# Altium project pca10040.PrjPCB (part 1 of 3)
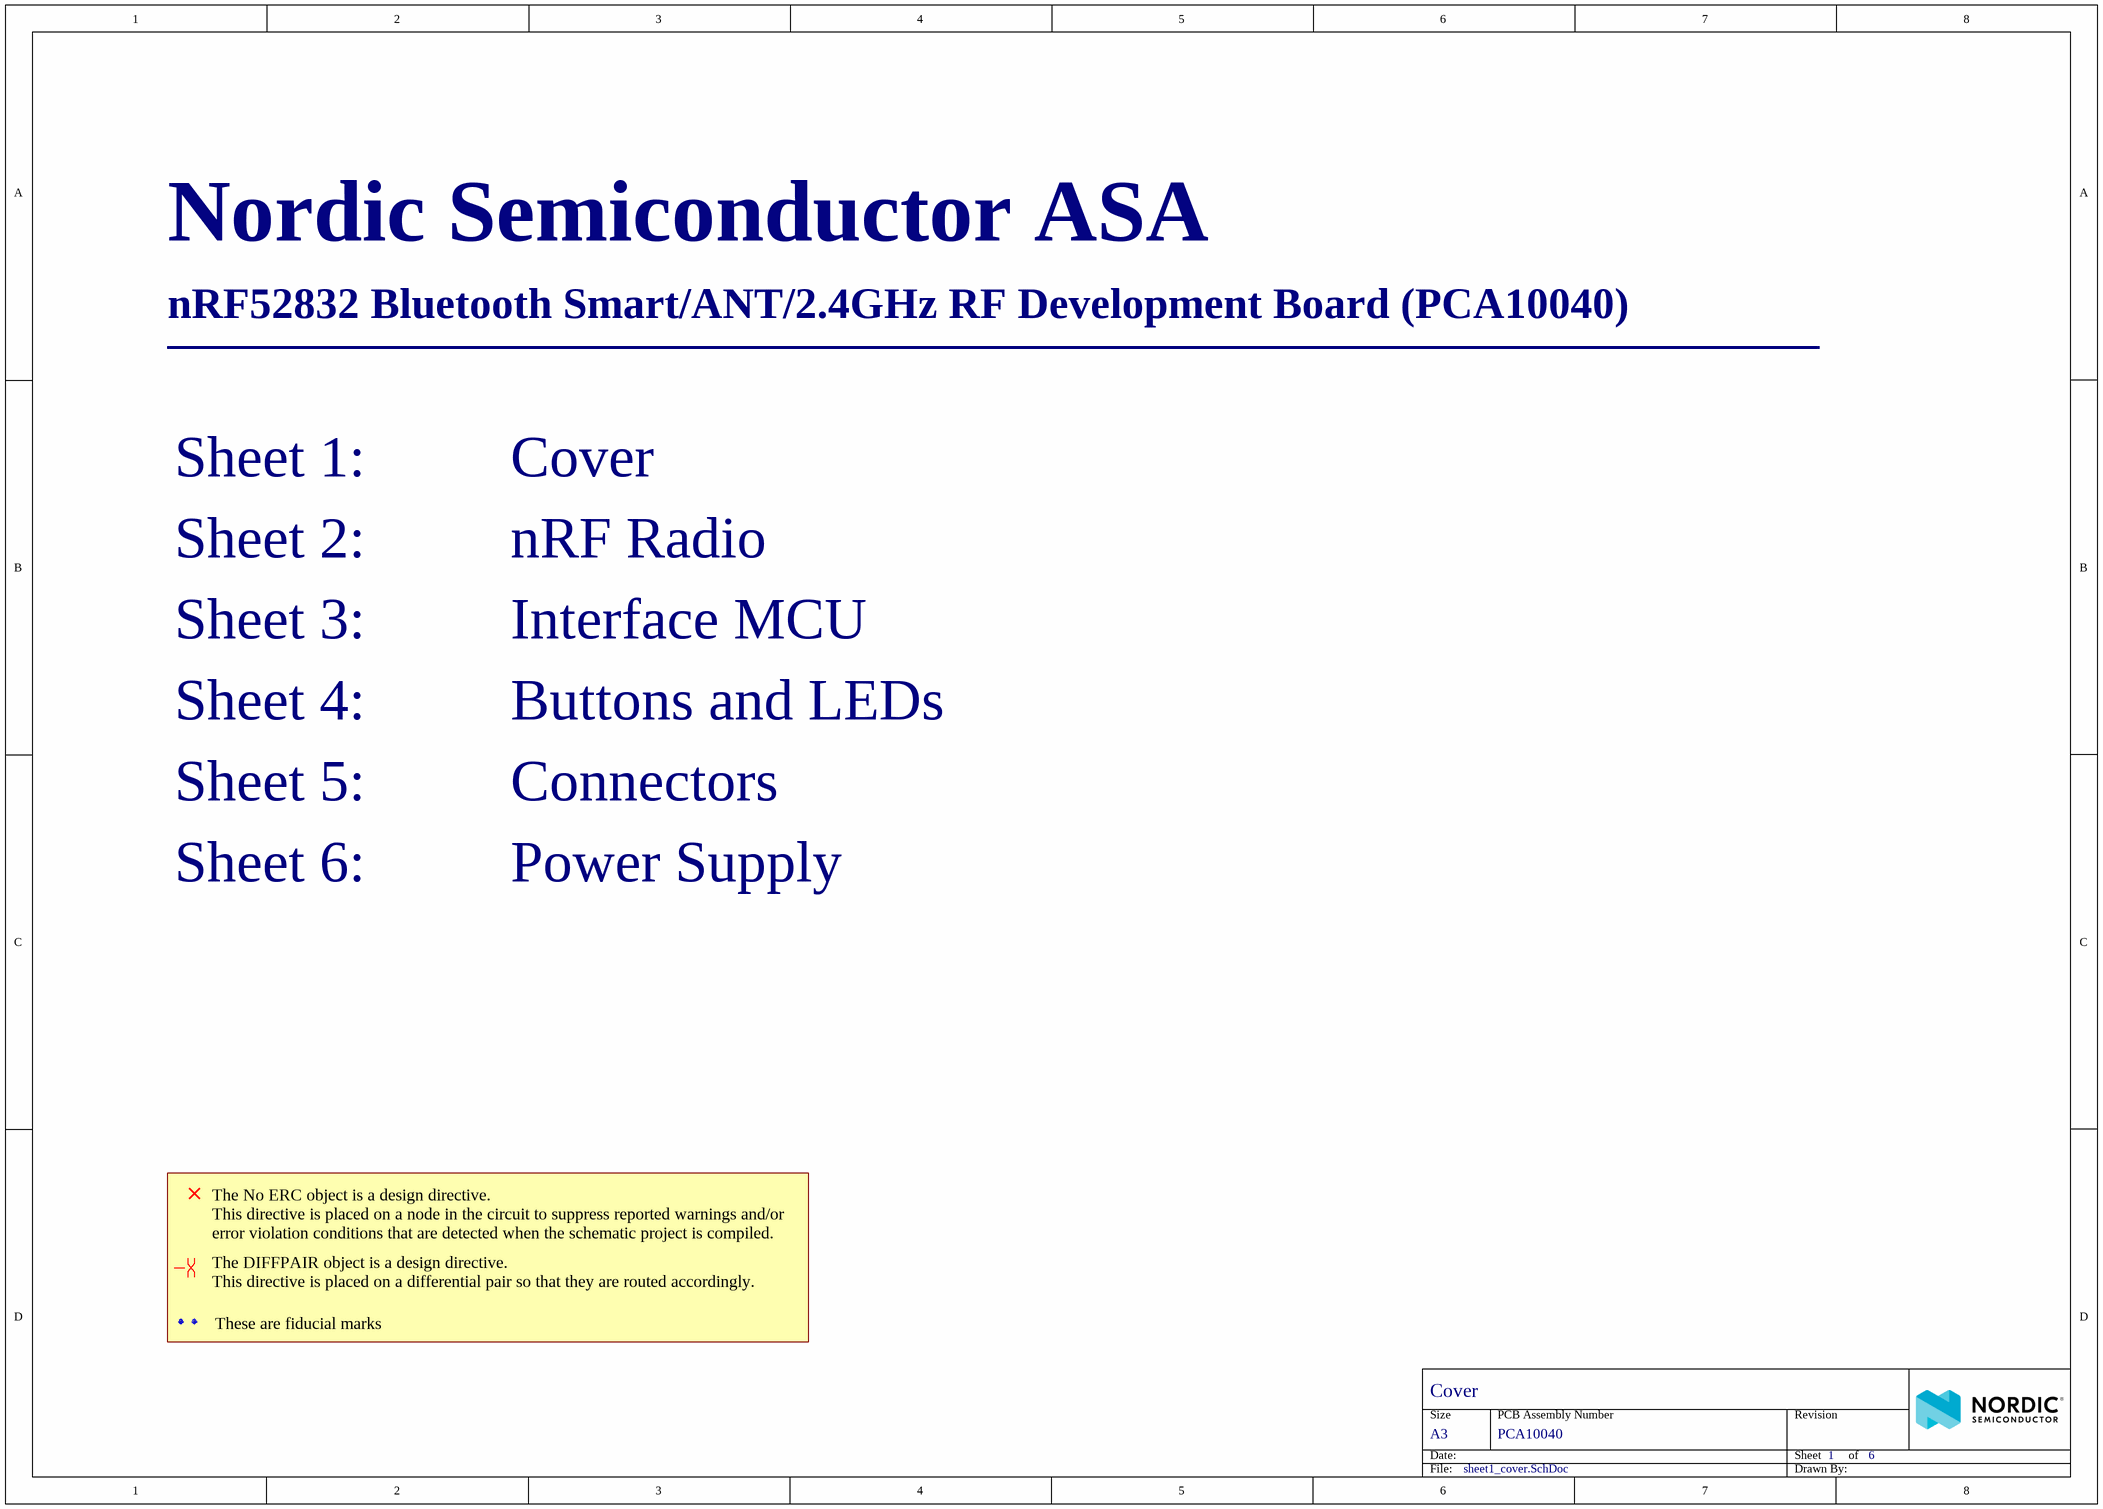
[diagram p0: sheet1_cover.SchDoc]
SurfaceFinish: ENIG; SoldermaskColor: Blue; SilkscreenColor: White; PCARevision: 3.0.0; ProductName: nRF52 DK; PCBStackup: 4001; PCBRevision: 0413RUBR; PCBNumber: 400150; PCAName: PCA10040; Organization: Nordic Semiconductor; NrOfLayers: 4; Dielectric: FR-4; Compliance: RoHS, REACH; BoardTitle: nRF52832 Development Board; BoardThickness: 1.6mm; Designer: KJP/RUBR/GETR/SIGE
6 sheets, 241 parts. Net scope: flat (ports and power ports of the same name join across sheets).
Board file: 400150.PcbDoc
Sheets:
  sheet1_cover.SchDoc
  sheet2_radio.SchDoc
  sheet3_interface_mcu.SchDoc
  sheet4_buttons_and_leds.SchDoc
  sheet5_connectors.SchDoc
  sheet6_power_supply.SchDoc

## Sheet sheet1_cover.SchDoc: Cover
size A3; Organization: Nordic Semiconductor; DocumentNumber: 1; Revision: 3.0.0; SheetNumber: 1; SheetTotal: 6; Author: KJP/RUBR/GETR/SIGE; CompanyName: Nordic Semiconductor; DrawnBy: KJP/RUBR/GETR/SIGE; DocumentSize: A3

### Parts
Fid1  Fiducial mark  [Fiducial]  (value not drawn)
Fid2  Fiducial mark  [Fiducial]  (value not drawn)

### Layout directives
differential pair: (no net found under the mark)

### Notes on the sheet
- Nordic Semiconductor ASA
- nRF52832 Bluetooth Smart/ANT/2.4GHz RF Development Board (PCA10040)
- ________________________________________________________
- Sheet 1:          Cover
- Sheet 2:          nRF Radio
- Sheet 3:          Interface MCU
- Sheet 4:          Buttons and LEDs
- Sheet 5:          Connectors
- Sheet 6:          Power Supply
- The No ERC object is a design directive.
  This directive is placed on a node in the circuit to suppress reported warnings and/or error violation conditions that are detected when the schematic project is compiled.
- The DIFFPAIR object is a design directive.
  This directive is placed on a differential pair so that they are routed accordingly.
- These are fiducial marks
- Size
- Date:
- A3
- PCB Assembly Number
- Sheet         of
- Revision
- File:
- Drawn By:

### Library data of the parts
Fid1 Fid2 = Fid-Mark: Manufacturer: N.A.; Value: N.A.; Pad Count: 1; Part Number: Fid-Mark; Manufacturer Part Number: N.A.; LatestRevisionDate: 2009-12-12; Published: 2009-12-12; Note: N.A.; Artikkelnr Noca: N.A.; Footprint Doc: Fiducial; Part number IPS: N.A.; ComponentLink1URL: N.A.; ComponentLink1Description: Datasheet; ComponentLink2URL: N.A.; ComponentLink2Description: Supplier link; HelpURL: N.A.; Supplier 1: N.A.; Supplier Part Number 1: N.A.; Supplier 2: N.A.; Supplier Part Number 2: N.A.; PartId: 100500073; Component Class: Connectors; Author: rsk; Part number Norautron: N.A.

## Sheet sheet2_radio.SchDoc: nRF52832 MCU
size A3; Organization: Nordic Semiconductor; DocumentNumber: 2; Revision: 3.0.0; SheetNumber: 2; SheetTotal: 6; Author: KJP/RUBR/GETR/SIGE; CompanyName: Nordic Semiconductor; DrawnBy: KJP/RUBR/GETR/SIGE; DocumentSize: A3
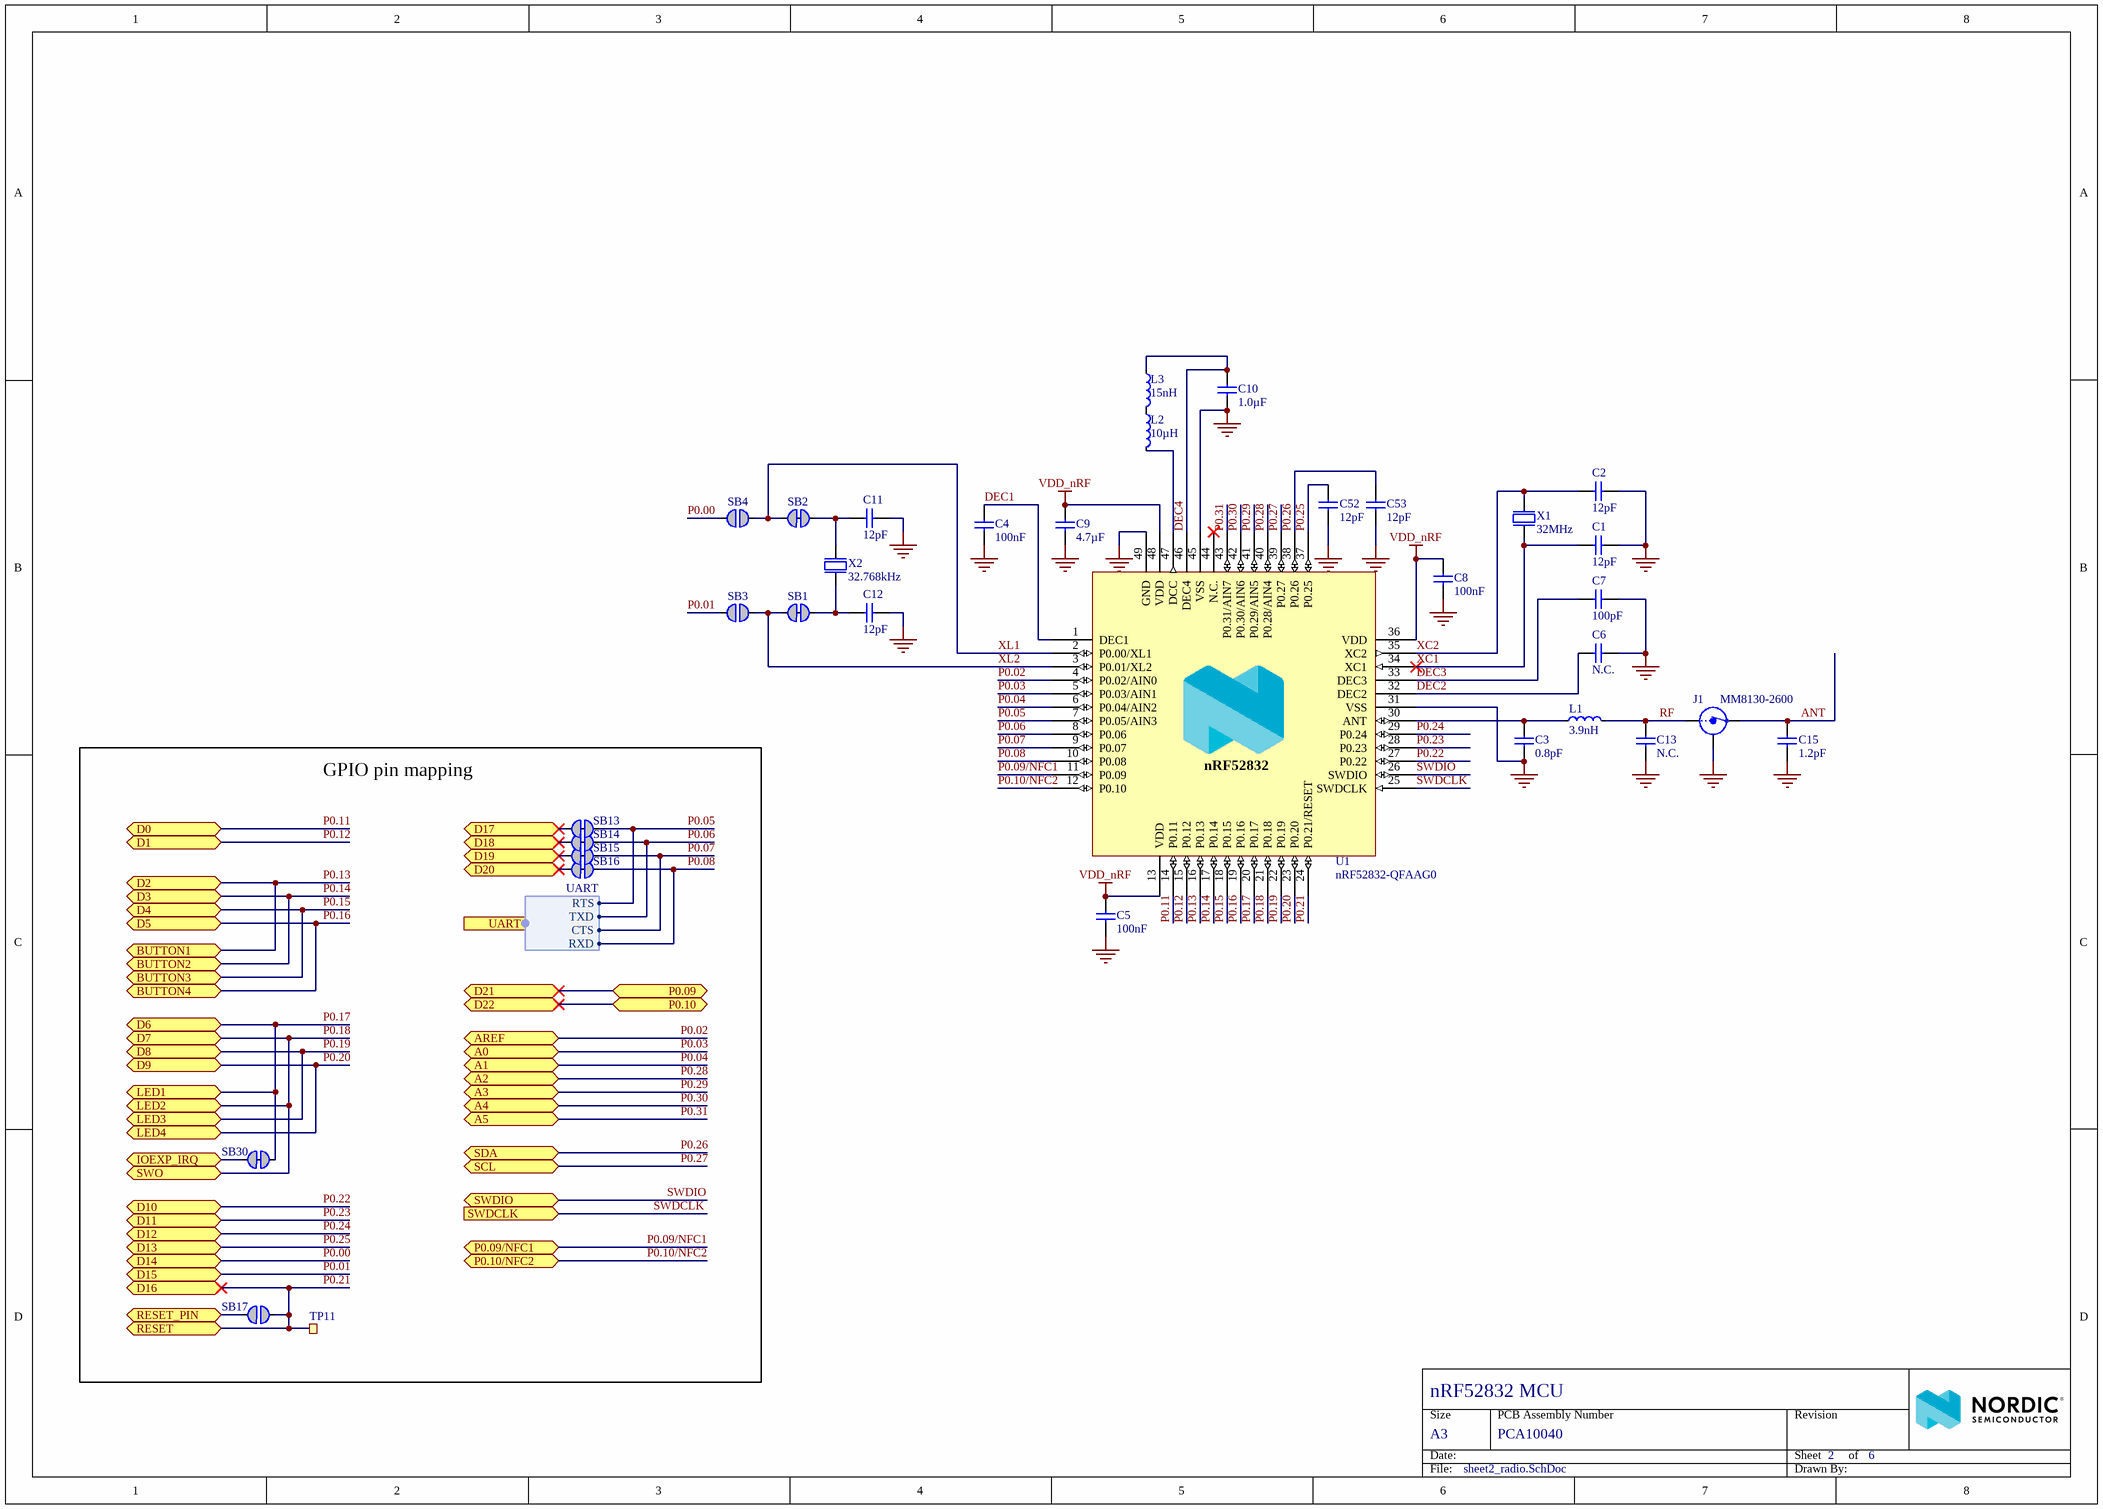
[diagram p1: sheet2_radio.SchDoc]

### Parts
C1  12pF  [CAPC1005X04L]
C2  12pF  [CAPC1005X04L]
C3  0.8pF  [CAPC1005X04L]
C4  100nF  [CAPC1005X04L]
C5  100nF  [CAPC1005X04L]
C6  N.C.  [CAPC1005X04L_NC]
C7  100pF  [CAPC1005X04L]
C8  100nF  [CAPC1005X04L]
C9  4.7µF  [CAPC1608X06L]
C10  1.0µF  [CAPC1608X06L]
C11  12pF  [CAPC1005X04L]
C12  12pF  [CAPC1005X04L]
C13  N.C.  [CAPC1005X04L_NC]
C15  1.2pF  [CAPC1005X04L]
C52  12pF  [CAPC1005X04L]
C53  12pF  [CAPC1005X04L]
J1  MM8130-2600  [COAXIAL-SWF]
L1  3.9nH  [INDC1005X04L]
L2  10µH  [INDC1608X06L]
L3  15nH  [INDC1005X04L]
SB1  Solderbridge  [Solderbridge_Shorted]  (value not drawn)  (net tie, no BOM)
SB2  Solderbridge  [Solderbridge_Shorted]  (value not drawn)  (net tie, no BOM)
SB3  Solderbridge  [Solderbridge]  (value not drawn)  (no BOM)
SB4  Solderbridge  [Solderbridge]  (value not drawn)  (no BOM)
SB13  Solderbridge  [Solderbridge_Shorted]  (value not drawn)  (net tie, no BOM)
SB14  Solderbridge  [Solderbridge_Shorted]  (value not drawn)  (net tie, no BOM)
SB15  Solderbridge  [Solderbridge_Shorted]  (value not drawn)  (net tie, no BOM)
SB16  Solderbridge  [Solderbridge_Shorted]  (value not drawn)  (net tie, no BOM)
SB17  Solderbridge  [Solderbridge]  (value not drawn)  (no BOM)
SB30  Solderbridge  [Solderbridge_Shorted]  (value not drawn)  (net tie, no BOM)
TP11  Ø1.0mm,SMD  [TP_SMD_D1.0mm]  (value not drawn)  (no BOM)
U1  nRF52832-QFAAG0  [QFN40P600X600X90-48N]
X1  32MHz  [BT-XTAL_2016]
X2  32.768kHz  [XTAL_3215]

### Blocks framed on the sheet
GPIO pin mapping: SB13-SB17 SB30 TP11

### Ports
A0 (bidir), A1 (bidir), A2 (bidir), A3 (bidir), A4 (bidir), A5 (bidir), AREF (bidir), BUTTON1 (bidir), BUTTON2 (bidir), BUTTON3 (bidir), BUTTON4 (bidir), D0 (bidir), D1 (bidir), D2 (bidir), D3 (bidir), D4 (bidir), D5 (bidir), D6 (bidir), D7 (bidir), D8 (bidir), D9 (bidir), D10 (bidir), D11 (bidir), D12 (bidir), D13 (bidir), D14 (bidir), D15 (bidir), D16 (bidir), D17 (bidir), D18 (bidir), D19 (bidir), D20 (bidir), D21 (bidir), D22 (bidir), IOEXP_IRQ (bidir), LED1 (bidir), LED2 (bidir), LED3 (bidir), LED4 (bidir), P0.09 (bidir), P0.09/NFC1 (bidir), P0.10 (bidir), P0.10/NFC2 (bidir), RESET (bidir), RESET_PIN (bidir), SCL (bidir), SDA (bidir), SWDCLK (in), SWDIO (bidir), SWO (bidir), UART (harness UART)

### Harnesses
UART: RTS, TXD, CTS, RXD

### Nets
GND: C1.2 C2.2 C3.1 C4.2 C5.2 C6.2 C7.2 C8.2 C9.2 C10.1 C11.1 C12.1 C13.2 C15.2 C52.2 C53.2 J1.2(Shield) U1.31(VSS) U1.45(VSS) U1.49(GND) X1.2(GND) X1.4(GND)
VDD_nRF: C5.1 C8.1 C9.1 U1.13(VDD) U1.36(VDD) U1.48(VDD)
ANT: C15.1 J1.3(OUT)
D17: SB13.1 ; port D17
D18: SB14.1 ; port D18
D19: SB15.1 ; port D19
D20: SB16.1 ; port D20
D21: port D21, port P0.09
D22: port D22, port P0.10
DEC1: C4.1 U1.1(DEC1)
DEC2: C6.1 U1.32(DEC2)
DEC3: C7.1 U1.33(DEC3)
DEC4: C10.2 L3.1 U1.46(DEC4)
P0.00: SB4.2 ; port D14  [project net D14]
P0.01: SB3.2 ; port D15  [project net D15]
P0.02: U1.4(P0.02/AIN0) ; port AREF
P0.03: U1.5(P0.03/AIN1) ; port A0
P0.04: U1.6(P0.04/AIN2) ; port A1
P0.05: SB13.2 U1.7(P0.05/AIN3) ; port UART.RTS
P0.06: SB14.2 U1.8(P0.06) ; port UART.TXD
P0.07: SB15.2 U1.9(P0.07) ; port UART.CTS  [project net CTS]
P0.08: SB16.2 U1.10(P0.08) ; port UART.RXD
P0.09/NFC1: U1.11(P0.09) ; port P0.09/NFC1
P0.10/NFC2: U1.12(P0.10) ; port P0.10/NFC2
P0.11: U1.14(P0.11) ; port D0  [project net D0]
P0.12: U1.15(P0.12) ; port D1  [project net D1]
P0.13: U1.16(P0.13) ; port D2, port BUTTON1  [project net D2]
P0.14: U1.17(P0.14) ; port D3, port BUTTON2  [project net D3]
P0.15: U1.18(P0.15) ; port D4, port BUTTON3  [project net D4]
P0.16: U1.19(P0.16) ; port D5, port BUTTON4  [project net D5]
P0.17: SB30.1 U1.20(P0.17) ; port D6, port LED1  [project net D6]
P0.18: U1.21(P0.18) ; port D7, port LED2, port SWO  [project net D7]
P0.19: U1.22(P0.19) ; port D8, port LED3  [project net D8]
P0.20: U1.23(P0.20) ; port D9, port LED4  [project net D9]
P0.21: SB17.2 TP11.1 U1.24(P0.21/RESET) ; port RESET, port D16  [project net D16]
P0.22: U1.27(P0.22) ; port D10  [project net D10]
P0.23: U1.28(P0.23) ; port D11  [project net D11]
P0.24: U1.29(P0.24) ; port D12  [project net D12]
P0.25: C52.1 U1.37(P0.25) ; port D13  [project net D13]
P0.26: C53.1 U1.38(P0.26) ; port SDA
P0.27: U1.39(P0.27) ; port SCL
P0.28: U1.40(P0.28/AIN4) ; port A2
P0.29: U1.41(P0.29/AIN5) ; port A3
P0.30: U1.42(P0.30/AIN6) ; port A4
P0.31: U1.43(P0.31/AIN7) ; port A5
RF: C13.1 J1.1(IN) L1.2
SWDCLK: U1.25(SWDCLK) ; port SWDCLK
SWDIO: U1.26(SWDIO) ; port SWDIO
XC1: C1.1 U1.34(XC1) X1.1(inp)
XC2: C2.1 U1.35(XC2) X1.3(out)
XL1: SB2.2 SB4.1 U1.2(P0.00/XL1)
XL2: SB1.2 SB3.1 U1.3(P0.01/XL2)
NetC3_2: C3.2 L1.1 U1.30(ANT)
NetC11_2: C11.2 SB2.1 X2.1(inp)
NetC12_2: C12.2 SB1.1 X2.2(out)
NetL2_1: L2.1 L3.2
NetL2_2: L2.2 U1.47(DCC)
NetP1_3: SB17.1 ; port RESET_PIN
NetSB30_2: SB30.2 ; port IOEXP_IRQ

Not connected (* = marked no-connect by the designer): U1 44(N.C.)*

### Notes on the sheet
- Size
- Date:
- A3
- PCB Assembly Number
- Sheet         of
- Revision
- File:
- Drawn By:
- (in symbol nRF52832-QFAAG0) nRF52832

### Library data of the parts
C1 C2 C11 C12 C52 C53 = C0402-12p: Capacitor, NP0, ±2%; Manufacturer: N.A.; Part number IPS: 00000002398; Note: 50V; Artikkelnr Noca: 20029159; Pad Count: 2; Part Number: C0402-12p; Manufacturer Part Number: N.A.; LatestRevisionDate: 2011-05-11; Published: 2009-05-08; Value: 12pF; Footprint Doc: 0402; ComponentLink1URL: N.A.; ComponentLink1Description: Datasheet; ComponentLink2URL: N.A.; ComponentLink2Description: Supplier link; HelpURL: N.A.; Supplier 1: N.A.; Supplier Part Number 1: N.A.; Supplier 2: N.A.; Supplier Part Number 2: N.A.; PartId: 100200137; Component Class: Capacitors; Author: rsk; Part number Norautron: N.A.
C3 = C0402-0.8p: Capacitor, NP0, ±5%; Manufacturer: Murata; Manufacturer Part Number: GRM1555C1HR80WA01D; Part number IPS: 00000007782; Part number Norautron: N.A.; Note: 50V; Artikkelnr Noca: 20029147; Pad Count: 2; Part Number: C0402-0.8p; LatestRevisionDate: 2012-11-21; Published: 2009-05-08; Value: 0.8pF; Footprint Doc: 0402; ComponentLink1URL: https://www.murata.com/~/media/webrenewal/support/library/catalog/products/capacitor/mlcc/c02e.ashx?la=en-us; ComponentLink1Description: Datasheet; ComponentLink2URL: N.A.; ComponentLink2Description: Supplier link; HelpURL: N.A.; Supplier 1: Digi-Key; Supplier Part Number 1: 490-6270-1-ND; Supplier 2: N.A.; Supplier Part Number 2: N.A.; PartId: 100200116; Component Class: Capacitors; Author: rsk
C4 C5 C8 = C0402-100n: Capacitor, X7R, ±10%; Manufacturer: N.A.; Part number IPS: 00000005296; Note: 16V; Artikkelnr Noca: 20039200; Pad Count: 2; Part Number: C0402-100n; Manufacturer Part Number: N.A.; LatestRevisionDate: 2009-11-23; Published: 2009-05-08; Value: 100nF; Footprint Doc: 0402; ComponentLink1URL: N.A.; ComponentLink1Description: Datasheet; ComponentLink2URL: N.A.; ComponentLink2Description: Supplier link; HelpURL: N.A.; Supplier 1: N.A.; Supplier Part Number 1: N.A.; Supplier 2: N.A.; Supplier Part Number 2: N.A.; PartId: 100200184; Component Class: Capacitors; Author: rsk; Part number Norautron: N.A.
C6 C13 = C0402-N.C.: Not mounted; Manufacturer: N.A.; Note: Chip Cap; Assembly: Not mounted; Pad Count: 2; Part Number: C0402-N.C.; Manufacturer Part Number: N.A.; Footprint Doc: 0402; LatestRevisionDate: 2009-05-08; Published: 2009-05-08; Value: N.C.; Artikkelnr Noca: N.A.; Part number IPS: N.A.; ComponentLink1URL: N.A.; ComponentLink1Description: Datasheet; ComponentLink2URL: N.A.; ComponentLink2Description: Supplier link; HelpURL: N.A.; Supplier 1: N.A.; Supplier Part Number 1: N.A.; Supplier 2: N.A.; Supplier Part Number 2: N.A.; PartId: 100200105; Component Class: Capacitors; Author: rsk; Part number Norautron: N.A.
C7 = C0402-100p: Capacitor, NP0, ±5%; Manufacturer: N.A.; Part number IPS: 00000002361; Note: 50V; Artikkelnr Noca: 20029135; Pad Count: 2; Part Number: C0402-100p; Manufacturer Part Number: N.A.; LatestRevisionDate: 2009-05-08; Published: 2009-05-08; Value: 100pF; Footprint Doc: 0402; ComponentLink1URL: N.A.; ComponentLink1Description: Datasheet; ComponentLink2URL: N.A.; ComponentLink2Description: Supplier link; HelpURL: N.A.; Supplier 1: N.A.; Supplier Part Number 1: N.A.; Supplier 2: N.A.; Supplier Part Number 2: N.A.; PartId: 100200148; Component Class: Capacitors; Author: rsk; Part number Norautron: N.A.
C9 = C0603-4µ7: Capacitor, X5R, ±10%; Manufacturer: N.A.; Part number IPS: 00000007783; Note: 6.3V; Artikkelnr Noca: 20069060; Pad Count: 2; Part Number: C0603-4µ7; Manufacturer Part Number: N.A.; LatestRevisionDate: 2009-11-23; Published: 2009-05-08; Value: 4.7µF; Footprint Doc: 0603; ComponentLink1URL: N.A.; ComponentLink1Description: Datasheet; ComponentLink2URL: N.A.; ComponentLink2Description: Supplier link; HelpURL: N.A.; Supplier 1: N.A.; Supplier Part Number 1: N.A.; Supplier 2: N.A.; Supplier Part Number 2: N.A.; PartId: 100200274; Component Class: Capacitors; Author: rsk; Part number Norautron: N.A.
C10 = C0603-1µ0: Capacitor, X7R, ±10%; Manufacturer: N.A.; Part number IPS: 00000000616; Note: 16V; Artikkelnr Noca: 20039282; Pad Count: 2; Part Number: C0603-1µ0; Manufacturer Part Number: N.A.; LatestRevisionDate: 2013-06-05; Published: 2009-05-08; Value: 1.0µF; Footprint Doc: 0603; ComponentLink1URL: N.A.; ComponentLink1Description: Datasheet; ComponentLink2URL: N.A.; ComponentLink2Description: Supplier link; HelpURL: N.A.; Supplier 1: N.A.; Supplier Part Number 1: N.A.; Supplier 2: N.A.; Supplier Part Number 2: N.A.; PartId: 100200271; Component Class: Capacitors; Author: rsk; Part number Norautron: N.A.
C15 = C0402-1.2p: Capacitor, NP0, ±0.1pF; Manufacturer: N.A.; Part number IPS: 00000005410; Note: 50V; Artikkelnr Noca: 20029157; Pad Count: 2; Part Number: C0402-1.2p; Manufacturer Part Number: N.A.; LatestRevisionDate: 2011-05-11; Published: 2009-05-08; Value: 1.2pF; Footprint Doc: 0402; ComponentLink1URL: N.A.; ComponentLink1Description: Datasheet; ComponentLink2URL: N.A.; ComponentLink2Description: Supplier link; HelpURL: N.A.; Supplier 1: N.A.; Supplier Part Number 1: N.A.; Supplier 2: N.A.; Supplier Part Number 2: N.A.; PartId: 100200119; Component Class: Capacitors; Author: rsk; Part number Norautron: N.A.
J1 = MM8130-2600: Coaxial Connector with Switch; Manufacturer: Murata; Part number IPS: 00000009955; Note: N.A.; Artikkelnr Noca: 55029011; Pad Count: 3; Part Number: MM8130-2600; Manufacturer Part Number: MM8130-2600; LatestRevisionDate: 2014-04-24; Published: 2014-04-24; Value: MM8130-2600; Footprint Doc: COAXIAL-SWF; ComponentLink1URL: N.A.; ComponentLink1Description: Datasheet; ComponentLink2URL: N.A.; ComponentLink2Description: Supplier link; HelpURL: http://www.murata.com/products/catalog/pdf/o33e.pdf; Supplier 1: Digi-Key; Supplier Part Number 1: 490-4981-1-ND; Supplier 2: Mouser; Supplier Part Number 2: 81-MM8130-2600RA2; PartId: 100500400; Component Class: Connectors; Author: rsk; Part number Norautron: N.A.
L1 = L0402-3n9: Inductor, 170mA, ±0.1nH; Manufacturer: Murata; Manufacturer Part Number: LQP15MN3N9B02D; Part number IPS: 00000007793; Part number Norautron: N.A.; Note: High frequency chip inductor ±5%; Artikkelnr Noca: 33029151; Pad Count: 2; Part Number: L0402-3n9; LatestRevisionDate: 2012-09-19; Published: 2009-05-08; Value: 3.9nH; Footprint Doc: 0402; ComponentLink1Description: Datasheet; ComponentLink2Description: Supplier link; ComponentLink1URL: N.A.; ComponentLink2URL: N.A.; HelpURL: http://search.murata.co.jp/Ceramy/image/img/PDF/ENG/L0075S0084LQP15M.pdf; Supplier 1: Digi-Key; Supplier Part Number 1: 490-1131-1-ND; Supplier 2: N.A.; Supplier Part Number 2: N.A.; PartId: 100300049; Component Class: Inductors; Author: rsk
L2 = L0603-10µ: Inductor, 80mA, ±10%; Manufacturer: Taiyo Yuden; Manufacturer Part Number: LBMF1608T100K; Part number IPS: 00000007794; Part number Norautron: N.A.; Note: LBMF1608T100K 10µH 80mA 0603; Artikkelnr Noca: 33029314; Pad Count: 2; Part Number: L0603-10µ; LatestRevisionDate: 2012-09-19; Published: 2010-02-24; Value: 10µH; Footprint Doc: 0603; ComponentLink1Description: Datasheet; ComponentLink2Description: Supplier link; ComponentLink1URL: N.A.; ComponentLink2URL: N.A.; HelpURL: http://www.yuden.co.jp/ut/product/pdf/elb2_e.pdf; Supplier 1: Digi-Key; Supplier Part Number 1: 587-1714-1-ND; Supplier 2: Farnell; Supplier Part Number 2: 178-6105; PartId: 100300078; Component Class: Inductors; Author: rsk
L3 = L0402-15n: Inductor, 320mA, ±5%; Manufacturer: Taiyo Yuden; Manufacturer Part Number: HK100515NJ-T; Part number IPS: 00000001262; Part number Norautron: N.A.; Note: High frequency chip inductor ±10%; Artikkelnr Noca: 33029323; Pad Count: 2; Part Number: L0402-15n; LatestRevisionDate: 2012-09-19; Published: 2010-07-12; Value: 15nH; Footprint Doc: 0402; ComponentLink1Description: Datasheet; ComponentLink2Description: Supplier link; ComponentLink1URL: N.A.; ComponentLink2URL: N.A.; HelpURL: http://www.yuden.co.jp/productdata/catalog/en/mlci04_e.pdf; Supplier 1: Digi-Key; Supplier Part Number 1: 587-1521-1-ND; Supplier 2: Farnell; Supplier Part Number 2: 658-1328; PartId: 100300056; Component Class: Inductors; Author: rsk
SB1 SB2 SB13-SB16 SB30 = Solderbridge Shorted: Shorted Solderbridge; Manufacturer: N.A.; Pad Count: 2; Part Number: Solderbridge Shorted; Manufacturer Part Number: N.A.; LatestRevisionDate: 2012-08-07; Published: 2012-08-07; Value: Solderbridge; Note: N.A.; Artikkelnr Noca: N.A.; Footprint Doc: Solderbridge_Shorted; Part number IPS: N.A.; ComponentLink1URL: N.A.; ComponentLink1Description: Datasheet; ComponentLink2URL: N.A.; ComponentLink2Description: Supplier link; HelpURL: N.A.; Supplier 1: N.A.; Supplier Part Number 1: N.A.; Supplier 2: N.A.; Supplier Part Number 2: N.A.; PartId: 100500459; Component Class: Connectors; Author: rsk; Part number Norautron: N.A.
SB3 SB4 SB17 = Solderbridge: Manufacturer: N.A.; Pad Count: 2; Part Number: Solderbridge; Manufacturer Part Number: N.A.; LatestRevisionDate: 2009-12-14; Published: 2009-12-14; Value: Solderbridge; Note: N.A.; Artikkelnr Noca: N.A.; Footprint Doc: Solderbridge; Part number IPS: N.A.; ComponentLink1URL: N.A.; ComponentLink1Description: Datasheet; ComponentLink2URL: N.A.; ComponentLink2Description: Supplier link; HelpURL: N.A.; Supplier 1: N.A.; Supplier Part Number 1: N.A.; Supplier 2: N.A.; Supplier Part Number 2: N.A.; PartId: 100500458; Component Class: Connectors; Author: rsk; Part number Norautron: N.A.
TP11 = TP_SMD_Ø1.0MM: 1.0mm circular SMD testpad; Manufacturer: Nordic Semiconductor; Manufacturer Part Number: N.A.; Pad Count: 1; Part Number: TP_SMD_Ø1.0MM; LatestRevisionDate: 2021-03-05; Published: 2013-06-11; Value: Ø1.0mm,SMD; Note: N.A.; Artikkelnr Noca: N.A.; Footprint Doc: TP_SMD_Ø1.0mm; Part number IPS: N.A.; ComponentLink1URL: N.A.; ComponentLink1Description: Datasheet; ComponentLink2URL: N.A.; ComponentLink2Description: Supplier link; HelpURL: N.A.; Supplier 1: N.A.; Supplier Part Number 1: N.A.; Supplier 2: N.A.; Supplier Part Number 2: N.A.; PartId: 100500475; Component Class: Connectors; Author: rsk; Part number Norautron: N.A.
U1 = nRF52832-QFAAG0: Multi-protocol Bluetooth Low Energy, ANT and 2.4GHz proprietary system-on-chip; Manufacturer: Nordic Semiconductor; Note: N.A.; Pad Count: 48; Part Number: nRF52832-QFAAG0; Manufacturer Part Number: nRF52832-QFAAG0; LatestRevisionDate: 2021-05-31; Published: 2021-05-31; Value: nRF52832-QFAAG0; Artikkelnr Noca: N.A.; Footprint Doc: QFN-48; Part number IPS: N.A.; ComponentLink1URL: N.A.; ComponentLink1Description: Datasheet; ComponentLink2URL: N.A.; ComponentLink2Description: Supplier link; HelpURL: N.A.; Supplier 1: Nordic Semiconductor; Supplier Part Number 1: nRF52832-QFAAG0; Supplier 2: N.A.; Supplier Part Number 2: N.A.; Component Class: nRF_Devices; Author: rubr; Part number Norautron: N.A.; PartId: 102000228
X1 = XTAL_SMD2016_32MHz_8pF_Epson: XTAL SMD 2016, 32MHz, Cl=8pF, Tol: ±10ppm, Stab: ±10ppm; Manufacturer: Epson Toyocom; Manufacturer Part Number: Q22FA12800025; Part number IPS: N.A.; Note: XTAL SMD 32.000MHz; Artikkelnr Noca: 22019238; Pad Count: 4; Part Number: XTAL_SMD2016_32MHz_8pF_Epson; LatestRevisionDate: 2014-11-27; Published: 2012-03-09; Value: 32MHz; Footprint Doc: XTAL_2016; ComponentLink1URL: N.A.; ComponentLink1Description: Datasheet; ComponentLink2URL: N.A.; ComponentLink2Description: Supplier link; HelpURL: http://www.epsondevice.com/docs/qd/en/DownloadServlet?id=ID000449; Supplier 1: Farnell; Supplier Part Number 1: 171-2806; Supplier 2: N.A.; Supplier Part Number 2: N.A.; PartId: 101600036; Component Class: Oscillators; Author: rsk; Part number Norautron: N.A.
X2 = XTAL_SMD3215_32.768kHz_9pF_Epson: XTAL SMD 3215, 32.768kHz, 9pF, ±20ppm; Manufacturer: Epson Toyocom; Manufacturer Part Number: FC-135 32.768KHZ ±20PPM,9.0PF; Part number IPS: N.A.; Note: XTAL SMD 32.768kHz; Artikkelnr Noca: 22019091; Pad Count: 2; Part Number: XTAL_SMD3215_32.768kHz_9pF_Epson; LatestRevisionDate: 2017-10-18; Published: 2010-10-18; Value: 32.768kHz; Footprint Doc: XTAL_3215; ComponentLink1URL: N.A.; ComponentLink1Description: Datasheet; ComponentLink2URL: N.A.; ComponentLink2Description: Supplier link; HelpURL: http://www.farnell.com/datasheets/57480.pdf; Supplier 1: Digi-Key; Supplier Part Number 1: FC-135 32.7680KA-AC-ND; Supplier 2: Farnell; Supplier Part Number 2: 127-8037; PartId: 101600021; Component Class: Oscillators; Author: rsk; Part number Norautron: N.A.

## Sheet sheet3_interface_mcu.SchDoc: Interface MCU
size A3; Organization: Nordic Semiconductor; DocumentNumber: 3; Revision: 3.0.0; SheetNumber: 3; SheetTotal: 6; Author: KJP/RUBR/GETR/SIGE; CompanyName: Nordic Semiconductor; DrawnBy: KJP/RUBR/GETR/SIGE; DocumentSize: A3
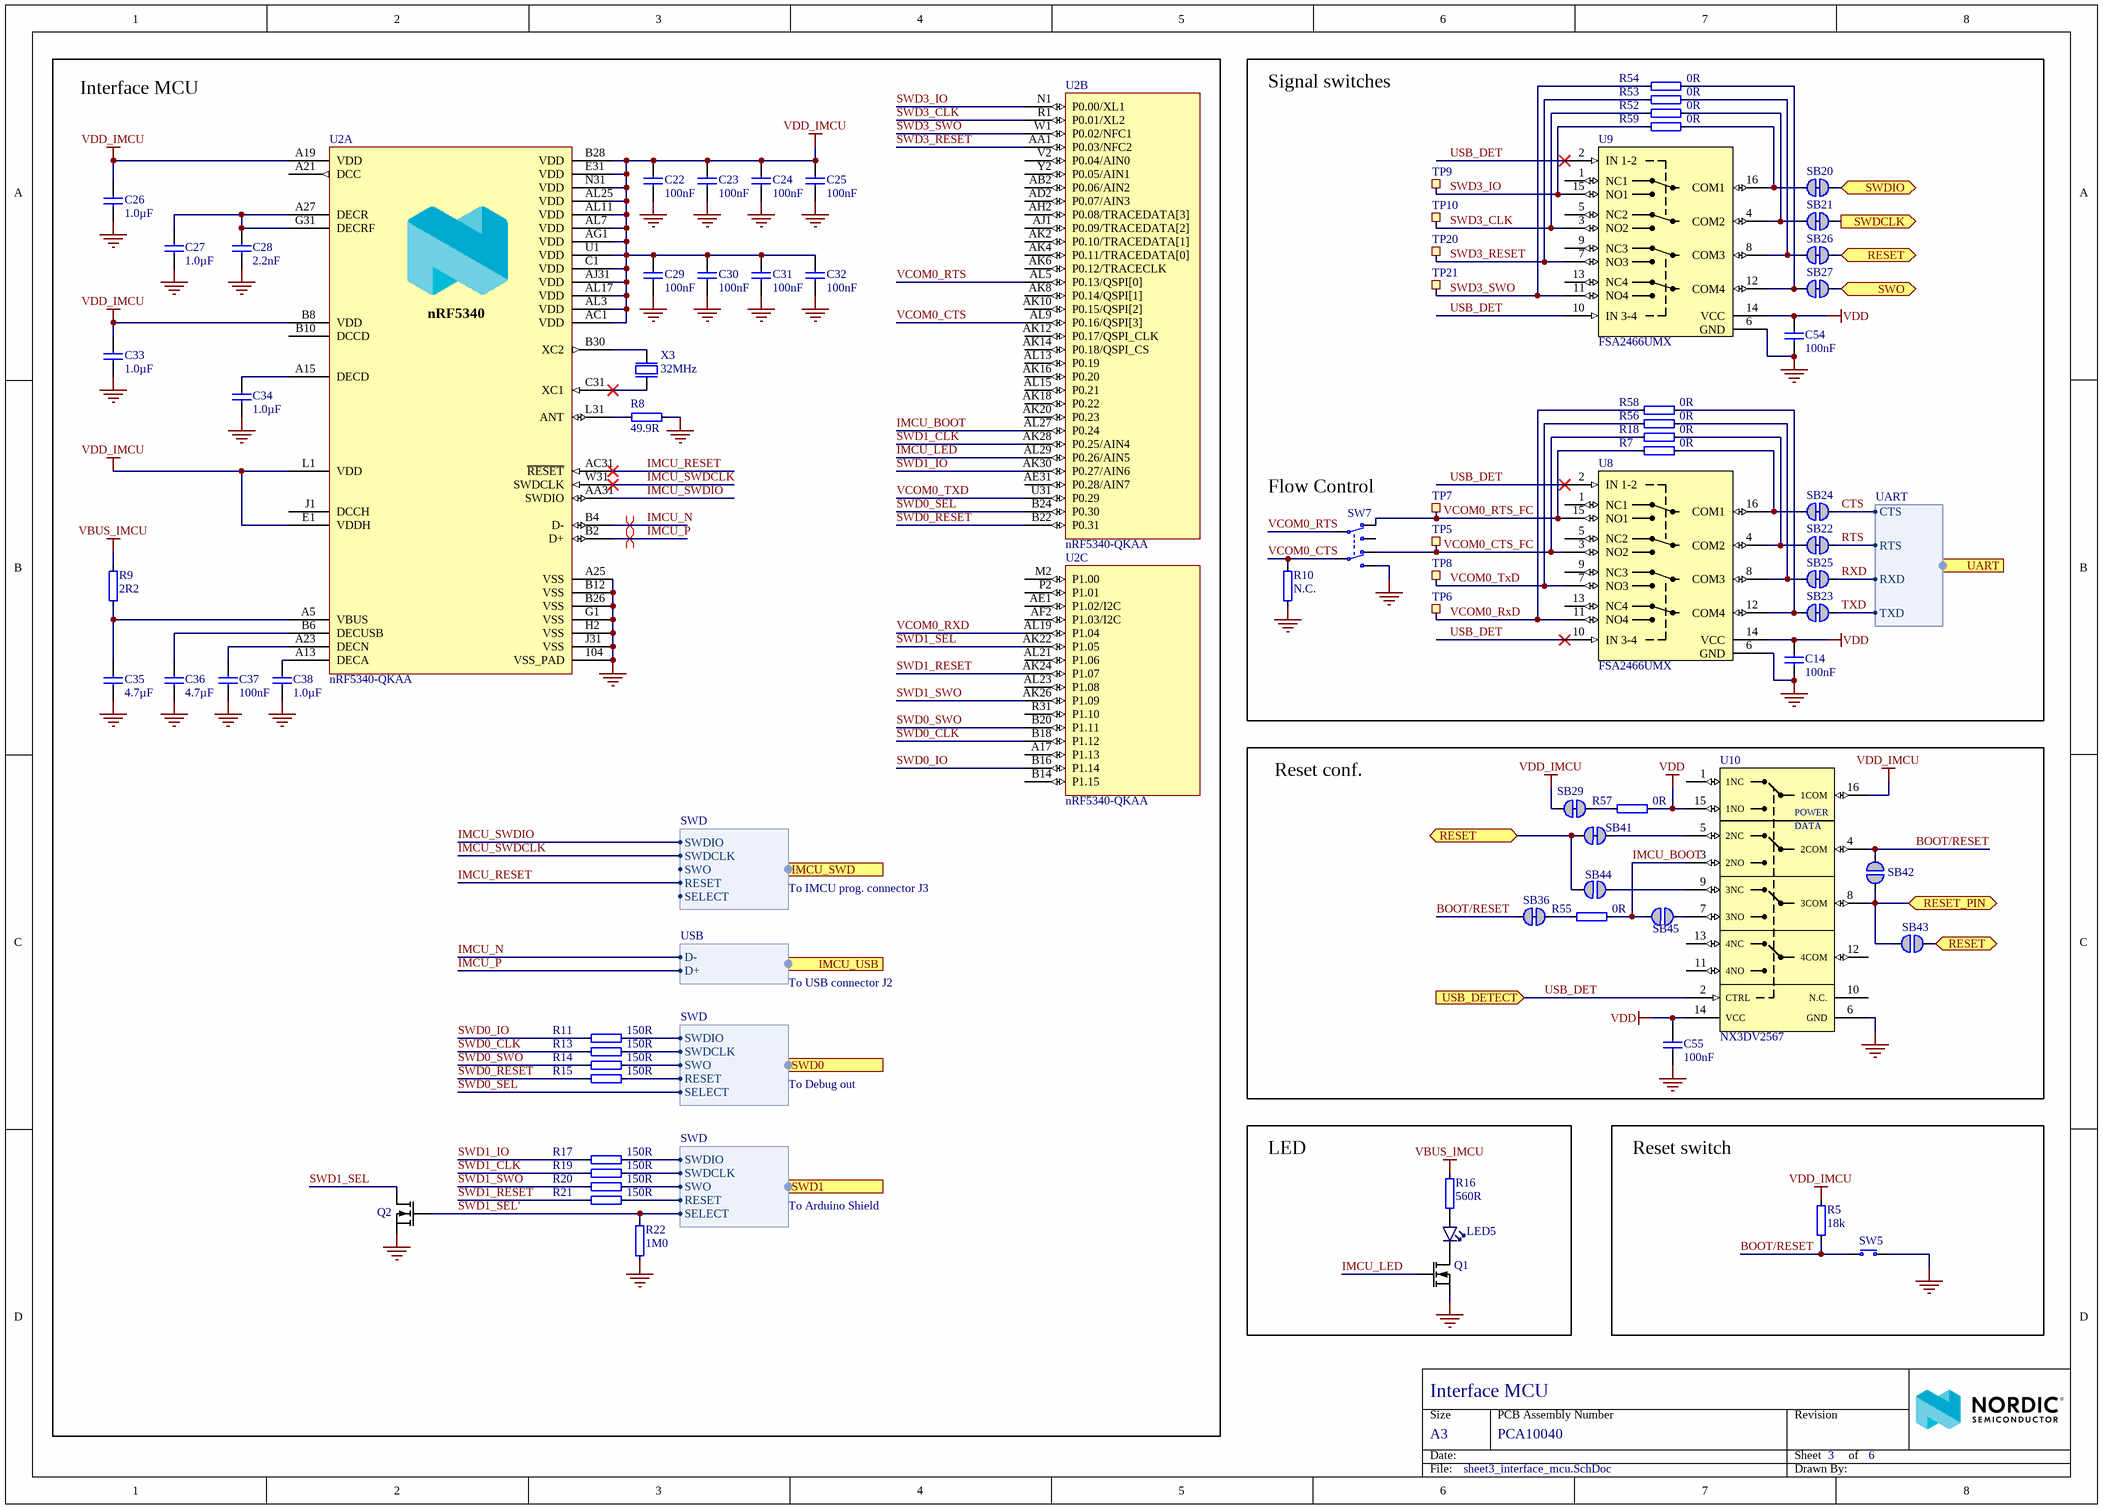
[diagram p2: sheet3_interface_mcu.SchDoc]

### Parts
C14  100nF  [CAPC1005X04L]
C22  100nF  [CAPC0603X03L_C]
C23  100nF  [CAPC0603X03L_C]
C24  100nF  [CAPC0603X03L_C]
C25  100nF  [CAPC0603X03L_C]
C26  1.0µF  [CAPC1005X04L]
C27  1.0µF  [CAPC1005X04L]
C28  2.2nF  [CAPC0603X03L_C]
C29  100nF  [CAPC0603X03L_C]
C30  100nF  [CAPC0603X03L_C]
C31  100nF  [CAPC0603X03L_C]
C32  100nF  [CAPC0603X03L_C]
C33  1.0µF  [CAPC1005X04L]
C34  1.0µF  [CAPC1005X04L]
C35  4.7µF  [CAPC1608X06L]
C36  4.7µF  [CAPC1608X06L]
C37  100nF  [CAPC0603X03L_C]
C38  1.0µF  [CAPC1005X04L]
C54  100nF  [CAPC1005X04L]
C55  100nF  [CAPC1005X04L]
LED5  L0603G  [LED_0603_G]  (value not drawn)
Q1  RV2C010UNT2L  [DFN65P100X40-3L]  (value not drawn)
Q2  RV2C010UNT2L  [DFN65P100X40-3L]  (value not drawn)
R5  18k  [RESC1005X04L]
R7  0R  [RESC1005X04L]
R8  49.9R  [RESC0603X03L_C]
R9  2R2  [RESC0603X03L_C]
R10  N.C.  [RESC0603X03L_C_NC]
R11  150R  [RESC0603X03L_C]
R13  150R  [RESC0603X03L_C]
R14  150R  [RESC0603X03L_C]
R15  150R  [RESC0603X03L_C]
R16  560R  [RESC0603X03L_C]
R17  150R  [RESC0603X03L_C]
R18  0R  [RESC1005X04L]
R19  150R  [RESC0603X03L_C]
R20  150R  [RESC0603X03L_C]
R21  150R  [RESC0603X03L_C]
R22  1M0  [RESC0603X03L_C]
R52  0R  [RESC1005X04L]
R53  0R  [RESC1005X04L]
R54  0R  [RESC1005X04L]
R55  0R  [RESC1005X04L]
R56  0R  [RESC1005X04L]
R57  0R  [RESC1005X04L]
R58  0R  [RESC1005X04L]
R59  0R  [RESC1005X04L]
SB20  Solderbridge  [Solderbridge_Shorted]  (value not drawn)  (net tie, no BOM)
SB21  Solderbridge  [Solderbridge_Shorted]  (value not drawn)  (net tie, no BOM)
SB22  Solderbridge  [Solderbridge_Shorted]  (value not drawn)  (net tie, no BOM)
SB23  Solderbridge  [Solderbridge_Shorted]  (value not drawn)  (net tie, no BOM)
SB24  Solderbridge  [Solderbridge_Shorted]  (value not drawn)  (net tie, no BOM)
SB25  Solderbridge  [Solderbridge_Shorted]  (value not drawn)  (net tie, no BOM)
SB26  Solderbridge  [Solderbridge_Shorted]  (value not drawn)  (net tie, no BOM)
SB27  Solderbridge  [Solderbridge_Shorted]  (value not drawn)  (net tie, no BOM)
SB29  Solderbridge  [Solderbridge_Shorted]  (value not drawn)  (net tie, no BOM)
SB36  Solderbridge  [Solderbridge_Shorted]  (value not drawn)  (net tie, no BOM)
SB41  Solderbridge  [Solderbridge_Shorted]  (value not drawn)  (net tie, no BOM)
SB42  Solderbridge  [Solderbridge]  (value not drawn)  (no BOM)
SB43  Solderbridge  [Solderbridge]  (value not drawn)  (no BOM)
SB44  Solderbridge  [Solderbridge]  (value not drawn)  (no BOM)
SB45  Solderbridge  [Solderbridge]  (value not drawn)  (no BOM)
SW5  PB SW  [Switch-PB-6.2x6.3mm-SMD]  (value not drawn)
SW7  CAS-220TA  [CAS-220TA]  (value not drawn)
TP5  Ø1.0mm,SMD  [TP_SMD_D1.0mm]  (value not drawn)  (no BOM)
TP6  Ø1.0mm,SMD  [TP_SMD_D1.0mm]  (value not drawn)  (no BOM)
TP7  Ø1.0mm,SMD  [TP_SMD_D1.0mm]  (value not drawn)  (no BOM)
TP8  Ø1.0mm,SMD  [TP_SMD_D1.0mm]  (value not drawn)  (no BOM)
TP9  Ø1.0mm,SMD  [TP_SMD_D1.0mm]  (value not drawn)  (no BOM)
TP10  Ø1.0mm,SMD  [TP_SMD_D1.0mm]  (value not drawn)  (no BOM)
TP20  Ø1.0mm,SMD  [TP_SMD_D1.0mm]  (value not drawn)  (no BOM)
TP21  Ø1.0mm,SMD  [TP_SMD_D1.0mm]  (value not drawn)  (no BOM)
U2  nRF5340-QKAA  [AQFN40P700X700X85_HS-99N]  (parts A,B,C of 3)
U8  FSA2466UMX  [XQFN40P180X260X50-16N]
U9  FSA2466UMX  [XQFN40P180X260X50-16N]
U10  NX3DV2567  [XQFN40P180X260X50-16N]
X3  32MHz  [BT-XTAL_2016]

### Blocks framed on the sheet
Interface MCU: C22-C38 Q2 R8 R9 R11 R13-R15 R17 R19-R22 U2 X3
Reset conf.: C55 R55 R57 SB29 SB36 SB41-SB45 U10
LED: LED5 Q1 R16
Reset switch: R5 SW5

### Ports
IMCU_SWD (harness SWD), IMCU_USB (harness USB), RESET (bidir), RESET_PIN (bidir), SWD0 (harness SWD), SWD1 (harness SWD), SWDCLK (out), SWDIO (bidir), SWO (bidir), UART (harness UART), USB_DETECT (in)

### Harnesses
SWD: SWDIO, SWDCLK, SWO, RESET, SELECT
USB: D-, D+
UART: CTS, RTS, RXD, TXD

### Nets
GND: C14.1 C22.2 C23.2 C24.2 C25.2 C26.2 C27.1 C28.2 C29.2 C30.2 C31.2 C32.2 C33.1 C34.1 C35.2 C36.2 C37.2 C38.1 C54.1 C55.1 Q1.2(S) Q2.2(S) R8.2 R10.1 R22.1 SW5.1(N.O) SW7.4(N.O-2) U2.104(VSS_PAD) U2.A25(VSS) U2.B12(VSS) U2.B26(VSS) U2.G1(VSS) U2.H2(VSS) U2.J31(VSS) U8.6(GND) U9.6(GND) U10.6(GND) X3.2(GND) X3.4(GND)
VBUS_IMCU: R9.1 R16.2
VDD: C14.2 C54.2 C55.2 R57.2 U8.14(VCC) U9.14(VCC) U10.14(VCC) U10.15(1NO)
VDD_IMCU: C22.1 C23.1 C24.1 C25.1 C26.1 C29.1 C30.1 C31.1 C32.1 C33.2 R5.2 SB29.2 U2.A19(VDD) U2.AC1(VDD) U2.AG1(VDD) U2.AJ31(VDD) U2.AL3(VDD) U2.AL7(VDD) U2.AL11(VDD) U2.AL17(VDD) U2.AL25(VDD) U2.B8(VDD) U2.B28(VDD) U2.C1(VDD) U2.E1(VDDH) U2.E31(VDD) U2.L1(VDD) U2.N31(VDD) U2.U1(VDD) U10.16(1COM)
BOOT/RESET: R5.1 SB36.2 SB42.1 SW5.2(COM) U10.4(2COM)
CTS: SB24.2 ; port UART.CTS
D7: SB27.2 ; port SWO
D16: SB26.2 SB41.2 SB43.2 SB44.2 ; port RESET
IMCU_BOOT: R55.2 SB45.2 U2.AL27(P0.24) U10.3(2NO)
IMCU_LED: Q1.1(G) U2.AL29(P0.26/AIN5)
IMCU_N: U2.B4(D-) ; port IMCU_USB.D-
IMCU_P: U2.B2(D+) ; port IMCU_USB.D+
IMCU_RESET: U2.AC31(~{RESET}) ; port IMCU_SWD.RESET
IMCU_SWDCLK: U2.W31(SWDCLK) ; port IMCU_SWD.SWDCLK
IMCU_SWDIO: U2.AA31(SWDIO) ; port IMCU_SWD.SWDIO
RESET: R15.2 ; port SWD0.RESET
RTS: SB22.2 ; port UART.RTS  [project net P0.05]
RXD: SB25.2 ; port UART.RXD  [project net P0.08]
SWCLK: R13.2 ; port SWD0.SWDCLK
SWD0_CLK: R13.1 U2.B18(P1.12)
SWD0_IO: R11.1 U2.B16(P1.14)
SWD0_RESET: R15.1 U2.B22(P0.31)
SWD0_SEL: U2.B24(P0.30) ; port SWD0.SELECT  [project net SELECT]
SWD0_SWO: R14.1 U2.B20(P1.11)
SWD1_CLK: R19.1 U2.AK28(P0.25/AIN4)
SWD1_IO: R17.1 U2.AK30(P0.27/AIN6)
SWD1_RESET: R21.1 U2.AK24(P1.07)
SWD1_SEL: Q2.3(D) U2.AK22(P1.05)
SWD1_SEL': Q2.1(G) R22.2 ; port SWD1.SELECT
SWD1_SWO: R20.1 U2.AK26(P1.09)
SWD3_CLK: R52.2 TP10.1 U2.R1(P0.01/XL2) U9.3(NO2)
SWD3_IO: R59.2 TP9.1 U2.N1(P0.00/XL1) U9.15(NO1)
SWD3_RESET: R53.2 TP20.1 U2.AA1(P0.03/NFC2) U9.7(NO3)
SWD3_SWO: R54.2 TP21.1 U2.W1(P0.02/NFC1) U9.11(NO4)
SWDCLK: SB21.2 ; port SWDCLK
SWDIO: SB20.2 ; port SWDIO
SWIO: R11.2 ; port SWD0.SWDIO
SWO: R14.2 ; port SWD0.SWO
TXD: SB23.2 ; port UART.TXD  [project net P0.06]
USB_DET: U8.2(IN_1-2) U8.10(IN_3-4) U9.2(IN_1-2) U9.10(IN_3-4) U10.2(CTRL) ; port USB_DETECT
VCOM0_CTS: R10.2 SW7.5(COM-2) U2.AL9(P0.16/QSPI[3])
VCOM0_CTS_FC: R18.2 SW7.6(N.C-2) TP5.1 U8.3(NO2)
VCOM0_RTS: SW7.2(COM-1) U2.AL5(P0.13/QSPI[0])
VCOM0_RTS_FC: R7.2 SW7.3(N.C-1) TP7.1 U8.15(NO1)
VCOM0_RxD: R58.2 TP6.1 U2.AL19(P1.04) U8.11(NO4)
VCOM0_TxD: R56.2 TP8.1 U2.U31(P0.29) U8.7(NO3)
NetC27_2: C27.2 C28.1 U2.A27(DECR) U2.G31(DECRF)
NetC34_2: C34.2 U2.A15(DECD)
NetC35_1: C35.1 R9.2 U2.A5(VBUS)
NetC36_1: C36.1 U2.B6(DECUSB)
NetC37_1: C37.1 U2.A23(DECN)
NetC38_2: C38.2 U2.A13(DECA)
NetLED5_1: LED5.1(C) Q1.3(D)
NetLED5_2: LED5.2(A) R16.1
NetP1_3: SB42.2 SB43.1 U10.8(3COM) ; port RESET_PIN
NetP20_4: R17.2 ; port SWD1.SWDIO
NetP20_5: R19.2 ; port SWD1.SWDCLK
NetP20_6: R20.2 ; port SWD1.SWO
NetP20_7: R21.2 ; port SWD1.RESET
NetR7_1: R7.1 SB24.1 U8.16(COM1)
NetR8_1: R8.1 U2.L31(ANT)
NetR18_1: R18.1 SB22.1 U8.4(COM2)
NetR52_1: R52.1 SB21.1 U9.4(COM2)
NetR53_1: R53.1 SB26.1 U9.8(COM3)
NetR54_1: R54.1 SB27.1 U9.12(COM4)
NetR55_1: R55.1 SB36.1
NetR56_1: R56.1 SB25.1 U8.8(COM3)
NetR57_1: R57.1 SB29.1
NetR58_1: R58.1 SB23.1 U8.12(COM4)
NetR59_1: R59.1 SB20.1 U9.16(COM1)
NetSB41_1: SB41.1 U10.5(2NC)
NetSB44_1: SB44.1 U10.9(3NC)
NetSB45_1: SB45.1 U10.7(3NO)
NetU2_B30: U2.B30(XC2) X3.3(out)
NetU2_C31: U2.C31(XC1) X3.1(inp)

Not connected (* = marked no-connect by the designer): SW7 1(N.O-1); U2 A17(P1.13) A21(DCC) AB2(P0.06/AIN2) AD2(P0.07/AIN3) AE1(P1.02/I2C) AE31(P0.28/AIN7) AF2(P1.03/I2C) AG31(N.C.) AH2(P0.08/TRACEDATA[3]) AJ1(P0.09/TRACEDATA[2]) AK2(P0.10/TRACEDATA[1]) AK4(P0.11/TRACEDATA[0]) AK6(P0.12/TRACECLK) AK8(P0.14/QSPI[1]) AK10(P0.15/QSPI[2]) AK12(P0.17/QSPI_CLK) AK14(P0.18/QSPI_CS) AK16(P0.20) AK18(P0.22) AK20(P0.23) AL13(P0.19) AL15(P0.21) AL21(P1.06) AL23(P1.08) B10(DCCD) B14(P1.15) D2(N.C.) F2(N.C.) J1(DCCH) M2(P1.00) P2(P1.01) R31(P1.10) T2(N.C.) V2(P0.04/AIN0) Y2(P0.05/AIN1); U8 1(NC1) 5(NC2) 9(NC3) 13(NC4); U9 1(NC1) 5(NC2) 9(NC3) 13(NC4); U10 1(1NC) 10(N.C.) 11(4NO) 12(4COM) 13(4NC)

### Layout directives
differential pair: IMCU_N, IMCU_P

### Notes on the sheet
- Signal switches
- (near SW7) Flow Control
- To IMCU prog. connector J3
- To USB connector J2
- To Debug out
- To Arduino Shield
- Size
- Date:
- A3
- PCB Assembly Number
- Sheet         of
- Revision
- File:
- Drawn By:
- (in symbol nRF5340-QKAAD0, part A) nRF5340
- (in symbol NX3DV2567GU) POWER; DATA

### Library data of the parts
C14 C54 C55 = C0402-100n: Capacitor, X7R, ±10%; Manufacturer: N.A.; Part number IPS: 00000005296; Note: 16V; Artikkelnr Noca: 20039200; Assembly: Not mounted; Pad Count: 2; Part Number: C0402-100n; Manufacturer Part Number: N.A.; Footprint Doc: 0402; LatestRevisionDate: 2009-11-23; Published: 2009-05-08; Value: 100nF; ComponentLink1URL: N.A.; ComponentLink1Description: Datasheet; ComponentLink2URL: N.A.; ComponentLink2Description: Supplier link; HelpURL: N.A.; Supplier 1: N.A.; Supplier Part Number 1: N.A.; Supplier 2: N.A.; Supplier Part Number 2: N.A.; PartId: 100200184; Component Class: Capacitors; Author: rsk; Part number Norautron: N.A.
C22-C25 C29-C32 C37 = C0201-100n: Capacitor, X5R, ±10%; Manufacturer: N.A.; Part number IPS: 00000001248, 00000002505; Pad Count: 2; Note: 16V; Part Number: C0201-100n; Value: 100nF; Footprint Doc: 0201; Component Class: Capacitors; Author: rsk; PartId: 100200078; Manufacturer Part Number: N.A.; ComponentLink1URL: N.A.; ComponentLink1Description: Datasheet; ComponentLink2URL: N.A.; ComponentLink2Description: Supplier link; HelpURL: N.A.; LatestRevisionDate: 2017-11-09; Published: 2014-11-13; Supplier 1: N.A.; Supplier Part Number 1: N.A.; Supplier 2: N.A.; Supplier Part Number 2: N.A.; Artikkelnr Noca: N.A.; Part number Norautron: N.A.
C26 C27 C33 C34 C38 = C0402-1µ0: Capacitor, X5R, ±5%, 6.3V; Manufacturer: N.A.; Part number IPS: 00000007786, 00000003457; Pad Count: 2; Artikkelnr Noca: 20039235; Part Number: C0402-1µ0; Value: 1.0µF; Footprint Doc: 0402; Component Class: Capacitors; Author: rsk; PartId: 100200190; Manufacturer Part Number: N.A.; ComponentLink1URL: N.A.; ComponentLink1Description: Datasheet; ComponentLink2URL: N.A.; ComponentLink2Description: Supplier link; HelpURL: N.A.; LatestRevisionDate: 2016-08-22; Published: 2009-05-08; Note: 6.3V; Supplier 1: Digi-Key; Supplier Part Number 1: 1276-1444-1-ND; Supplier 2: N.A.; Supplier Part Number 2: N.A.; Part number Norautron: N.A.
C28 = C0201-2n2: Capacitor, X7R, ±10%, 10V; Manufacturer: N.A.; Part number IPS: 00000001778; Pad Count: 2; Part Number: C0201-2n2; Value: 2.2nF; Footprint Doc: 0201; Component Class: Capacitors; Author: rsk; PartId: 100200060; Manufacturer Part Number: N.A.; ComponentLink1URL: N.A.; ComponentLink1Description: Datasheet; ComponentLink2URL: N.A.; ComponentLink2Description: Supplier link; HelpURL: N.A.; LatestRevisionDate: 2014-11-13; Published: 2014-11-13; Note: 10V; Supplier 1: N.A.; Supplier Part Number 1: N.A.; Supplier 2: N.A.; Supplier Part Number 2: N.A.; Artikkelnr Noca: N.A.; Part number Norautron: N.A.
C35 = C0603-4µ7-10V-X7S: Capacitor, X7S, ±10%, 10V; Manufacturer: N.A.; Part number IPS: 00000001779; Pad Count: 2; Artikkelnr Noca: 20030013; Part Number: C0603-4µ7-10V-X7S; Value: 4.7µF; Footprint Doc: 0603; Component Class: Capacitors; Author: rsk; PartId: 100200351; Manufacturer Part Number: N.A.; ComponentLink1URL: N.A.; ComponentLink1Description: Datasheet; ComponentLink2URL: N.A.; ComponentLink2Description: Supplier link; HelpURL: N.A.; LatestRevisionDate: 2016-08-15; Published: 2016-08-15; Note: 10V; Supplier 1: Digi-Key; Supplier Part Number 1: 445-14258-1-ND; Supplier 2: N.A.; Supplier Part Number 2: N.A.; Part number Norautron: N.A.
C36 = C0603-4µ7-6.3V-X7R: Capacitor, X7R, ±10%, 6.3V; Manufacturer: Samsung Electro-Mechanics America; Manufacturer Part Number: CL10B475KQ8NQNC; Part number IPS: 00000002541; Part number Norautron: N.A.; Pad Count: 2; Artikkelnr Noca: 20039473; Part Number: C0603-4µ7-6.3V-X7R; Value: 4.7µF; Footprint Doc: 0603; Component Class: Capacitors; Author: rsk; PartId: 100200350; ComponentLink1URL: N.A.; ComponentLink1Description: Datasheet; ComponentLink2URL: N.A.; ComponentLink2Description: Supplier link; HelpURL: http://media.digikey.com/pdf/Data%20Sheets/Samsung%20PDFs/CL10B475KQ8NQNC_Spec.pdf; LatestRevisionDate: 2015-06-10; Published: 2015-06-10; Note: 6.3V; Supplier 1: Digi-Key; Supplier Part Number 1: 1276-2087-1-ND; Supplier 2: N.A.; Supplier Part Number 2: N.A.
LED5 = LG L29K Smartled Green: LED, Green, 0603, 570nm, Vf=1.7V, 2.24..5.6mcd, - 40 to +100°C; Manufacturer: Osram; Manufacturer Part Number: LG L29K-G2J1-24-Z; Part number IPS: 00000009961; Part number Norautron: N.A.; Note: 2.24..5.6 mcd, Vfmin=1.7V; Artikkelnr Noca: 13019147; Pad Count: 2; Part Number: LG L29K Smartled Green; Footprint Doc: 0603; LatestRevisionDate: 2017-08-21; Published: 2014-10-28; Value: L0603G; ComponentLink1URL: N.A.; ComponentLink1Description: Datasheet; ComponentLink2URL: N.A.; ComponentLink2Description: Supplier link; HelpURL: http://www.osram-os.com/Graphics/XPic2/00077107_0.pdf; Supplier 1: Digi-Key; Supplier Part Number 1: 475-2709-1-ND; Supplier 2: Mouser; Supplier Part Number 2: 720-LGL29KG2J124Z; PartId: 101400096; Component Class: Optoelectronics; Author: rsk
Q1 = RV2C010UNT2L: N-Channel MOSFET, 20V, 1A, 470mOhm, 400mW; Manufacturer: Rohm Semiconductor; Part number IPS: 00000009976; Note: N.A.; Artikkelnr Noca: 35010020; Pad Count: 3; Part Number: RV2C010UNT2L; Manufacturer Part Number: RV2C010UNT2L; ComponentLink1URL: N.A.; ComponentLink1Description: Datasheet; ComponentLink2URL: N.A.; ComponentLink2Description: Supplier link; HelpURL: http://rohmfs.rohm.com/en/products/databook/datasheet/discrete/transistor/mosfet/rv2c010unt2l-e.pdf; Footprint Doc: DFN-3; LatestRevisionDate: 2016-08-09; Published: 2016-08-09; Value: RV2C010UNT2L; Supplier 1: Digi-Key; Supplier Part Number 1: RV2C010UNT2LCT-ND; Supplier 2: Mouser; Supplier Part Number 2: 755-RV2C010UNT2L; PartId: 101300132; Component Class: Semiconductors; Author: rsk; Part number Norautron: N.A.
Q2 = RV2C010UNT2L: N-Channel MOSFET, 20V, 1A, 470mOhm, 400mW; Manufacturer: Rohm Semiconductor; Part number IPS: 00000009976; Pad Count: 3; Note: N.A.; Artikkelnr Noca: 35010020; Part Number: RV2C010UNT2L; PartId: 101300132; Component Class: Semiconductors; Author: rsk; Manufacturer Part Number: RV2C010UNT2L; ComponentLink1URL: N.A.; ComponentLink1Description: Datasheet; ComponentLink2URL: N.A.; ComponentLink2Description: Supplier link; HelpURL: http://rohmfs.rohm.com/en/products/databook/datasheet/discrete/transistor/mosfet/rv2c010unt2l-e.pdf; Footprint Doc: DFN-3; LatestRevisionDate: 2016-08-09; Published: 2016-08-09; Value: RV2C010UNT2L; Supplier 1: Digi-Key; Supplier Part Number 1: RV2C010UNT2LCT-ND; Supplier 2: Mouser; Supplier Part Number 2: 755-RV2C010UNT2L; Part number Norautron: N.A.
R5 = R0402-18k: Resistor, ±1%, 0.063W; Manufacturer: N.A.; Part number IPS: 00000003300; Note: Chip Res 1%; Artikkelnr Noca: 27049103; Pad Count: 2; Part Number: R0402-18k; Manufacturer Part Number: N.A.; Footprint Doc: 0402; LatestRevisionDate: 2009-11-23; Published: 2009-05-08; Value: 18k; ComponentLink1URL: N.A.; ComponentLink1Description: Datasheet; ComponentLink2URL: N.A.; ComponentLink2Description: Supplier link; HelpURL: N.A.; Supplier 1: Farnell; Supplier Part Number 1: 173-8867; Supplier 2: N.A.; Supplier Part Number 2: N.A.; PartId: 100100208; Component Class: Resistors; Author: rsk; Part number Norautron: N.A.
R7 R18 R52-R59 = R0402-0R: Resistor, ±5%, 0.063W; Manufacturer: N.A.; Part number IPS: 00000007128; Assembly: Not mounted; Note: Chip Res 5%; Artikkelnr Noca: 27049000; Pad Count: 2; Part Number: R0402-0R; Manufacturer Part Number: N.A.; Footprint Doc: 0402; LatestRevisionDate: 2009-11-23; Published: 2009-05-08; Value: 0R; ComponentLink1URL: N.A.; ComponentLink1Description: Datasheet; ComponentLink2URL: N.A.; ComponentLink2Description: Supplier link; HelpURL: N.A.; Supplier 1: Farnell; Supplier Part Number 1: 146-9661; Supplier 2: N.A.; Supplier Part Number 2: N.A.; PartId: 100100109; Component Class: Resistors; Author: rsk; Part number Norautron: N.A.
R8 = R0201-49R9: Resistor, ±1%, 0.05W; Manufacturer: N.A.; Pad Count: 2; Note: Chip Res 1%; Part Number: R0201-49R9; PartId: 100100612; Component Class: Resistors; Author: getr; Manufacturer Part Number: N.A.; ComponentLink1URL: N.A.; ComponentLink1Description: Datasheet; ComponentLink2URL: N.A.; ComponentLink2Description: Supplier link; HelpURL: N.A.; Footprint Doc: 0201; LatestRevisionDate: 2021-04-15; Published: 2021-04-15; Value: 49.9R; Supplier 1: N.A.; Supplier Part Number 1: N.A.; Supplier 2: N.A.; Supplier Part Number 2: N.A.; Artikkelnr Noca: N.A.; Part number IPS: N.A.; Part number Norautron: N.A.
R9 = R0201-2R2: Resistor, ±1%, 0.05W; Manufacturer: N.A.; Pad Count: 2; Note: Chip Res 1%; Part Number: R0201-2R2; Footprint Doc: 0201; Value: 2R2; Component Class: Resistors; Author: rsk; PartId: 100100006; Manufacturer Part Number: N.A.; ComponentLink1URL: N.A.; ComponentLink1Description: Datasheet; ComponentLink2URL: N.A.; ComponentLink2Description: Supplier link; HelpURL: N.A.; LatestRevisionDate: 2014-11-13; Published: 2014-11-13; Supplier 1: N.A.; Supplier Part Number 1: N.A.; Supplier 2: N.A.; Supplier Part Number 2: N.A.; Artikkelnr Noca: N.A.; Part number IPS: N.A.; Part number Norautron: N.A.
R10 = R0201-N.C.: Not mounted; Manufacturer: N.A.; Pad Count: 2; Note: Chip Res; Assembly: Not mounted; Part Number: R0201-N.C.; PartId: 100100107; Component Class: Resistors; Author: rsk; Manufacturer Part Number: N.A.; ComponentLink1URL: N.A.; ComponentLink1Description: Datasheet; ComponentLink2URL: N.A.; ComponentLink2Description: Supplier link; HelpURL: N.A.; Footprint Doc: 0201; LatestRevisionDate: 2014-11-13; Published: 2014-11-13; Value: N.C.; Supplier 1: N.A.; Supplier Part Number 1: N.A.; Supplier 2: N.A.; Supplier Part Number 2: N.A.; Artikkelnr Noca: N.A.; Part number IPS: N.A.; Part number Norautron: N.A.
R11 R13-R15 R17 R19-R21 = R0201-150: Resistor, ±1%, 0.05W; Manufacturer: N.A.; Part number IPS: 00000001420; Pad Count: 2; Note: Chip Res 1%; Part Number: R0201-150; PartId: 100100029; Component Class: Resistors; Author: rsk; Manufacturer Part Number: N.A.; ComponentLink1URL: N.A.; ComponentLink1Description: Datasheet; ComponentLink2URL: N.A.; ComponentLink2Description: Supplier link; HelpURL: N.A.; Footprint Doc: 0201; LatestRevisionDate: 2014-11-13; Published: 2014-11-13; Value: 150R; Supplier 1: N.A.; Supplier Part Number 1: N.A.; Supplier 2: N.A.; Supplier Part Number 2: N.A.; Artikkelnr Noca: N.A.; Part number Norautron: N.A.
R16 = R0201-560: Resistor, ±1%, 0.05W; Manufacturer: N.A.; Note: Chip Res 1%; Pad Count: 2; Part Number: R0201-560; Manufacturer Part Number: N.A.; ComponentLink1URL: N.A.; ComponentLink1Description: Datasheet; ComponentLink2URL: N.A.; ComponentLink2Description: Supplier link; HelpURL: N.A.; Footprint Doc: 0201; LatestRevisionDate: 2014-11-13; Published: 2014-11-13; Value: 560R; Supplier 1: N.A.; Supplier Part Number 1: N.A.; Supplier 2: N.A.; Supplier Part Number 2: N.A.; Artikkelnr Noca: N.A.; Part number IPS: N.A.; PartId: 100100038; Component Class: Resistors; Author: rsk; Part number Norautron: N.A.
R22 = R0201-1M0: Resistor, ±1%, 0.05W; Manufacturer: N.A.; Part number IPS: 00000001418; Pad Count: 2; Note: Chip Res 1%; Part Number: R0201-1M0; PartId: 100100093; Component Class: Resistors; Author: rsk; Manufacturer Part Number: N.A.; ComponentLink1URL: N.A.; ComponentLink1Description: Datasheet; ComponentLink2URL: N.A.; ComponentLink2Description: Supplier link; HelpURL: N.A.; Footprint Doc: 0201; LatestRevisionDate: 2014-11-13; Published: 2014-11-13; Value: 1M0; Supplier 1: N.A.; Supplier Part Number 1: N.A.; Supplier 2: N.A.; Supplier Part Number 2: N.A.; Artikkelnr Noca: N.A.; Part number Norautron: N.A.
SB20-SB27 SB29 SB36 SB41 = Solderbridge Shorted: as SB1 on sheet sheet2_radio; Part Number: Solderbridge Shorted; Manufacturer Part Number: N.A.; Footprint Doc: Solderbridge_Shorted; LatestRevisionDate: 2012-08-07; Published: 2012-08-07; Value: Solderbridge; Note: N.A.; Artikkelnr Noca: N.A.; Part number IPS: N.A.; ComponentLink1URL: N.A.; ComponentLink1Description: Datasheet; ComponentLink2URL: N.A.; ComponentLink2Description: Supplier link; HelpURL: N.A.; Supplier 1: N.A.; Supplier Part Number 1: N.A.; Supplier 2: N.A.; Supplier Part Number 2: N.A.; PartId: 100500459; Component Class: Connectors; Author: rsk; Part number Norautron: N.A.
SB42-SB45 = Solderbridge: Manufacturer: N.A.; Pad Count: 2; Part Number: Solderbridge; Manufacturer Part Number: N.A.; Footprint Doc: Solderbridge; LatestRevisionDate: 2009-12-14; Published: 2009-12-14; Value: Solderbridge; Note: N.A.; Artikkelnr Noca: N.A.; Part number IPS: N.A.; ComponentLink1URL: N.A.; ComponentLink1Description: Datasheet; ComponentLink2URL: N.A.; ComponentLink2Description: Supplier link; HelpURL: N.A.; Supplier 1: N.A.; Supplier Part Number 1: N.A.; Supplier 2: N.A.; Supplier Part Number 2: N.A.; PartId: 100500458; Component Class: Connectors; Author: rsk; Part number Norautron: N.A.
SW5 = Switch-PB-6.2x6.3mm-SMD: Tactile Switch, SPNO, SMD, 160gf, 6.2x6.3x2.5mm; Manufacturer: Dailywell; Manufacturer Part Number: TS604VM1-025BR-R; Part number IPS: 00000007812; Note: N.A.; Artikkelnr Noca: 50019106; Pad Count: 4; Part Number: Switch-PB-6.2x6.3mm-SMD; Footprint Doc: Switch-PB-6.2x6.3mm-SMD; LatestRevisionDate: 2016-04-21; Published: 2010-02-01; Value: PB SW; ComponentLink1URL: N.A.; ComponentLink1Description: Datasheet; ComponentLink2URL: N.A.; ComponentLink2Description: Supplier link; HelpURL: \\hizz\pro\app9717\Datasheet\switches\Dailywell\TS604VM1-025BR-R.pdf; Supplier 1: Cabcon; Supplier Part Number 1: TS604VM1-025BR-R; Supplier 2: Mouser; Supplier Part Number 2: 688-SKHUALE010; PartId: 101500001; Component Class: Switches; Author: rsk; Part number Norautron: N.A.
SW7 = CAS-220TA: Slide Switch DPDT J Hook; Manufacturer: Copal Electronics Inc; Part number IPS: 00000009983; Pad Count: 6; Note: N.A.; Artikkelnr Noca: 50019042; Part Number: CAS-220TA; PartId: 101500003; Component Class: Switches; Author: rsk; Manufacturer Part Number: CAS-220TA; ComponentLink1URL: N.A.; ComponentLink1Description: Datasheet; ComponentLink2URL: N.A.; ComponentLink2Description: Supplier link; HelpURL: http://media.digikey.com/pdf/Data%20Sheets/COPAL%20Electronics%20PDFs/CAS%20SMD%20Slide%20Switch.pdf; Footprint Doc: CAS-220TA; LatestRevisionDate: 2010-02-18; Published: 2010-02-18; Value: CAS-220TA; Supplier 1: Digi-Key; Supplier Part Number 1: CAS220JTR-ND; Supplier 2: N.A.; Supplier Part Number 2: N.A.; Part number Norautron: N.A.
TP5-TP10 TP20 TP21 = TP_SMD_Ø1.0MM: as TP11 on sheet sheet2_radio; Part Number: TP_SMD_Ø1.0MM; LatestRevisionDate: 2021-03-05; Published: 2013-06-11; Value: Ø1.0mm,SMD; Note: N.A.; Artikkelnr Noca: N.A.; Footprint Doc: TP_SMD_Ø1.0mm; Part number IPS: N.A.; ComponentLink1URL: N.A.; ComponentLink1Description: Datasheet; ComponentLink2URL: N.A.; ComponentLink2Description: Supplier link; HelpURL: N.A.; Supplier 1: N.A.; Supplier Part Number 1: N.A.; Supplier 2: N.A.; Supplier Part Number 2: N.A.; PartId: 100500475; Component Class: Connectors; Author: rsk; Part number Norautron: N.A.
U2 = nRF5340-QKAAD0: Multi-protocol Bluetooth Low Energy, IEEE 802.15.4, ANT and 2.4GHz proprietary system-on-chip; Manufacturer: Nordic Semiconductor; Pad Count: 98; Note: N.A.; Part Number: nRF5340-QKAAD0; Footprint Doc: AQFN-98; Value: nRF5340-QKAA; Component Class: nRF_Devices; Author: rsk; PartId: 102000216; Manufacturer Part Number: nRF5340-QKAAD0; ComponentLink1URL: N.A.; ComponentLink1Description: Datasheet; ComponentLink2URL: N.A.; ComponentLink2Description: Supplier link; HelpURL: N.A.; LatestRevisionDate: 2020-12-02; Published: 2020-12-02; Supplier 1: Nordic Semiconductor; Supplier Part Number 1: nRF5340-QKAAD0; Supplier 2: N.A.; Supplier Part Number 2: N.A.; Artikkelnr Noca: N.A.; Part number IPS: N.A.; Part number Norautron: N.A.
U8 U9 = FSA2466UMX: Data / Audio Low-Voltage Dual DPDT Analog Switch; Manufacturer: ON Semiconductor; Part number IPS: 00000009986; Note: N.A.; Artikkelnr Noca: 15070069; Assembly: Not mounted; Pad Count: 16; Part Number: FSA2466UMX; Manufacturer Part Number: FSA2466UMX; Footprint Doc: UFQFN-16; LatestRevisionDate: 2019-05-15; Published: 2016-05-18; Value: FSA2466UMX; ComponentLink1URL: N.A.; ComponentLink1Description: Datasheet; ComponentLink2URL: N.A.; ComponentLink2Description: Supplier link; HelpURL: https://www.onsemi.com/pub/Collateral/FSA2466-D.PDF; Supplier 1: Digi-Key; Supplier Part Number 1: FSA2466UMXCT-ND; Supplier 2: Mouser; Supplier Part Number 2: 512-FSA2466UMX; PartId: 101900422; Component Class: Misc_ICs; Author: rsk; Part number Norautron: N.A.
U10 = NX3DV2567GU: Low-ohmic four-pole double-throw analog switch; Manufacturer: NXP Semiconductors; Part number IPS: 00000007816; Assembly: Not mounted; Note: N.A.; Artikkelnr Noca: 15079317; Pad Count: 16; Part Number: NX3DV2567GU; Manufacturer Part Number: NX3DV2567GU; Footprint Doc: XQFN-16; LatestRevisionDate: 2015-02-17; Published: 2015-02-17; Value: NX3DV2567; ComponentLink1URL: N.A.; ComponentLink1Description: Datasheet; ComponentLink2URL: N.A.; ComponentLink2Description: Supplier link; HelpURL: http://www.nxp.com/documents/data_sheet/NX3DV2567.pdf; Supplier 1: Digi-Key; Supplier Part Number 1: 568-5206-1-ND; Supplier 2: Mouser; Supplier Part Number 2: 771-NX3DV2567GU115; PartId: 101900290; Component Class: Misc_ICs; Author: rsk; Part number Norautron: N.A.
X3 = XTAL_SMD2016_32MHz_8pF_Epson: as X1 on sheet sheet2_radio; Part Number: XTAL_SMD2016_32MHz_8pF_Epson; LatestRevisionDate: 2014-11-27; Published: 2012-03-09; Value: 32MHz; Footprint Doc: XTAL_2016; ComponentLink1URL: N.A.; ComponentLink1Description: Datasheet; ComponentLink2URL: N.A.; ComponentLink2Description: Supplier link; HelpURL: http://www.epsondevice.com/docs/qd/en/DownloadServlet?id=ID000449; Supplier 1: Farnell; Supplier Part Number 1: 171-2806; Supplier 2: N.A.; Supplier Part Number 2: N.A.; PartId: 101600036; Component Class: Oscillators; Author: rsk; Part number Norautron: N.A.